# EAGLE design stm32103c8t6-v7 (EAGLE 7.4.0)
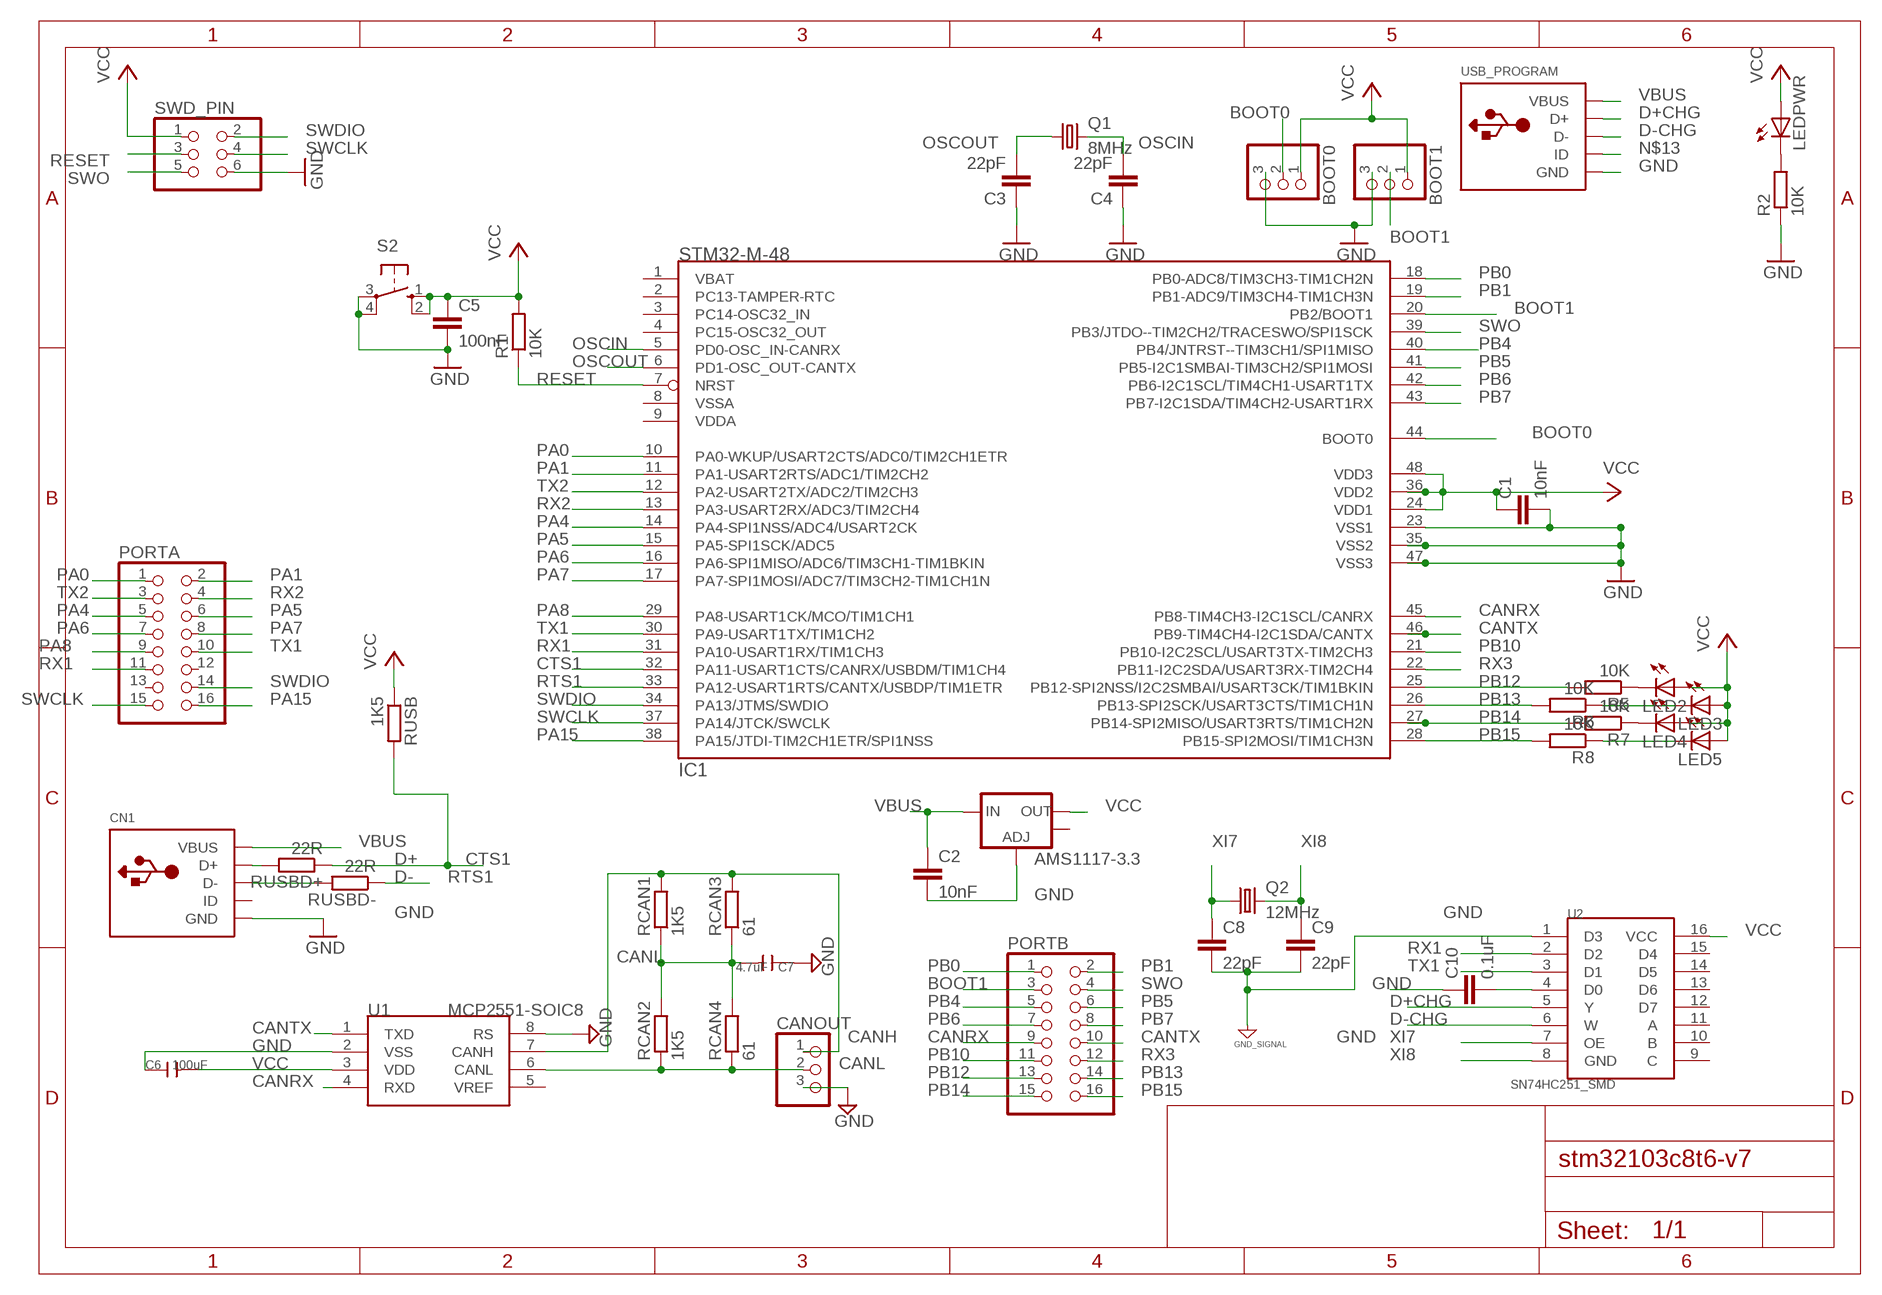
[diagram p0: schematic, sheet 1]

## Parts
AMS1117-3.3  V_REG_LM1117SOT223  [SOT223]
BOOT0  PINHD-1X3  [1X03]
BOOT1  PINHD-1X3  [1X03]
C1  10nF  C-EUC1210  [C1210]
C2  10nF  C-EUC1206  [C1206]
C3  22pF  C-EUC1210  [C1210]
C4  22pF  C-EUC1210  [C1210]
C5  100nF  C-EUC1206  [C1206]
C6  100uF  C-1206  [C1206]
C7  4.7uF  C-1206  [C1206]
C8  22pF  C-EUC1206  [C1206]
C9  22pF  C-EUC1206  [C1206]
C10  0.1uF  C-EUC1206  [C1206]
CANOUT  PINHD-1X3  [1X03]
CN1  USBTHM  [USB-MINIB-THM]
IC1  STM32-M-48  [LQFP48]
LED2  LEDSMT1206  [1206]
LED3  LEDSMT1206  [1206]
LED4  LEDSMT1206  [1206]
LED5  LEDSMT1206  [1206]
LEDPWR  LEDSMT1206  [1206]
PORTA  PINHD-2X8  [2X08]
PORTB  PINHD-2X8  [2X08]
Q1  8MHz  CRYSTALHC49S  [HC49/S]
Q2  12MHz  CRYSTALHC49S  [HC49/S]
R1  10K  R-EU_R1206  [R1206]
R2  10K  R-EU_R1206  [R1206]
R5  10K  R-EU_R1206  [R1206]
R6  10K  R-EU_R1206  [R1206]
R7  10K  R-EU_R1206  [R1206]
R8  10K  R-EU_R1206  [R1206]
RCAN1  1K5  R-EU_R1206  [R1206]
RCAN2  1K5  R-EU_R1206  [R1206]
RCAN3  61  R-EU_R1206  [R1206]
RCAN4  61  R-EU_R1206  [R1206]
RUSB  1K5  R-EU_R1206  [R1206]
RUSBD+  22R  R-EU_R1206  [R1206]
RUSBD-  22R  R-EU_R1206  [R1206]
S2  10-XX  [B3F-10XX]
SWD_PIN  PINHD-2X3  [2X03]
U1  MCP2551-SOIC8  [SOIC8-6.0]
U2  SN74HC251_SMD  [SO016]
USB_PROGRAM  USBTHM  [USB-MINIB-THM]

## Nets
BOOT0: BOOT0.2 IC1.44(BOOT0)
BOOT1: BOOT1.2 IC1.20(PB2/BOOT1) PORTB.3
CANH [CAN]: CANOUT.1 RCAN1.2 RCAN3.2 U1.7(CANH)
CANL [CAN]: CANOUT.2 RCAN2.1 RCAN4.1 U1.6(CANL)
CANRX: IC1.45(PB8-TIM4CH3-I2C1SCL/CANRX) PORTB.9 U1.4(RXD)
CANTX: IC1.46(PB9-TIM4CH4-I2C1SDA/CANTX) PORTB.10 U1.1(TXD)
CTS1: IC1.32(PA11-USART1CTS/CANRX/USBDM/TIM1CH4) RUSB.2 RUSBD+.1
D+: CN1.D+ RUSBD+.2
D+CHG: U2.5(Y) USB_PROGRAM.D+
D-: CN1.D- RUSBD-.2
D-CHG: U2.6(W) USB_PROGRAM.D-
GND [GND]: AMS1117-3.3.1(ADJ) BOOT0.3 BOOT1.3 C1.2 C2.2 C3.1 C4.1 C5.2 C6.1 C7.1 C8.2 C9.2 C10.1 CANOUT.3 CN1.GND IC1.23(VSS1) IC1.35(VSS2) IC1.47(VSS3) R2.1 S2.3(P) S2.4(P1) SWD_PIN.6 U1.2(VSS) U1.8(RS) U2.1(D3) USB_PROGRAM.GND ; supply symbol labelled GND_SIGNAL
N$4: LEDPWR.C R2.2
N$6: LED2.C R5.1
N$7: LED3.C R6.1
N$8: LED4.C R7.1
N$9: LED5.C R8.1
N$11: C10.2 U2.4(D0)
N$13: USB_PROGRAM.ID
OSCIN: C4.2 IC1.5(PD0-OSC_IN-CANRX) Q1.2
OSCOUT: C3.2 IC1.6(PD1-OSC_OUT-CANTX) Q1.1
PA0: IC1.10(PA0-WKUP/USART2CTS/ADC0/TIM2CH1ETR) PORTA.1
PA1: IC1.11(PA1-USART2RTS/ADC1/TIM2CH2) PORTA.2
PA4: IC1.14(PA4-SPI1NSS/ADC4/USART2CK) PORTA.5
PA5: IC1.15(PA5-SPI1SCK/ADC5) PORTA.6
PA6: IC1.16(PA6-SPI1MISO/ADC6/TIM3CH1-TIM1BKIN) PORTA.7
PA7: IC1.17(PA7-SPI1MOSI/ADC7/TIM3CH2-TIM1CH1N) PORTA.8
PA8: IC1.29(PA8-USART1CK/MCO/TIM1CH1) PORTA.9
PA15: IC1.38(PA15/JTDI-TIM2CH1ETR/SPI1NSS) PORTA.16
PB0: IC1.18(PB0-ADC8/TIM3CH3-TIM1CH2N) PORTB.1
PB1: IC1.19(PB1-ADC9/TIM3CH4-TIM1CH3N) PORTB.2
PB4: IC1.40(PB4/JNTRST--TIM3CH1/SPI1MISO) PORTB.5
PB5: IC1.41(PB5-I2C1SMBAI-TIM3CH2/SPI1MOSI) PORTB.6
PB6: IC1.42(PB6-I2C1SCL/TIM4CH1-USART1TX) PORTB.7
PB7: IC1.43(PB7-I2C1SDA/TIM4CH2-USART1RX) PORTB.8
PB10: IC1.21(PB10-I2C2SCL/USART3TX-TIM2CH3) PORTB.11
PB12: IC1.25(PB12-SPI2NSS/I2C2SMBAI/USART3CK/TIM1BKIN) PORTB.13 R5.2
PB13: IC1.26(PB13-SPI2SCK/USART3CTS/TIM1CH1N) PORTB.14 R6.2
PB14: IC1.27(PB14-SPI2MISO/USART3RTS/TIM1CH2N) PORTB.15 R7.2
PB15: IC1.28(PB15-SPI2MOSI/TIM1CH3N) PORTB.16 R8.2
RESET: IC1.7(NRST) R1.1 SWD_PIN.3
RTS1: IC1.33(PA12-USART1RTS/CANTX/USBDP/TIM1ETR) RUSBD-.1
RX1: IC1.31(PA10-USART1RX/TIM1CH3) PORTA.11 U2.2(D2)
RX2: IC1.13(PA3-USART2RX/ADC3/TIM2CH4) PORTA.4
RX3: IC1.22(PB11-I2C2SDA/USART3RX-TIM2CH4) PORTB.12
SWCLK: IC1.37(PA14/JTCK/SWCLK) PORTA.15 SWD_PIN.4
SWDIO: IC1.34(PA13/JTMS/SWDIO) PORTA.14 SWD_PIN.2
SWO: IC1.39(PB3/JTDO--TIM2CH2/TRACESWO/SPI1SCK) PORTB.4 SWD_PIN.5
TX1: IC1.30(PA9-USART1TX/TIM1CH2) PORTA.10 U2.3(D1)
TX2: IC1.12(PA2-USART2TX/ADC2/TIM2CH3) PORTA.3
UNIC: C7.2 RCAN1.1 RCAN2.2 RCAN3.1 RCAN4.2
VBUS: AMS1117-3.3.3(IN) C2.1 CN1.VBUS USB_PROGRAM.VBUS
VCC [POWER]: AMS1117-3.3.2(OUT) BOOT0.1 BOOT1.1 C1.1 C5.1 C6.2 IC1.24(VDD1) IC1.36(VDD2) IC1.48(VDD3) LED2.A LED3.A LED4.A LED5.A LEDPWR.A R1.2 RUSB.1 S2.1(S) S2.2(S1) SWD_PIN.1 U1.3(VDD) U2.16(VCC)
XI7: C8.1 Q2.1 U2.7(OE)
XI8: C9.1 Q2.2 U2.8(GND)
Unconnected: AMS1117-3.3.4(OUT) CN1.ID IC1.1(VBAT) IC1.2(PC13-TAMPER-RTC) IC1.3(PC14-OSC32_IN) IC1.4(PC15-OSC32_OUT) IC1.8(VSSA) IC1.9(VDDA) PORTA.12 PORTA.13 U1.5(VREF) U2.9(C) U2.10(B) U2.11(A) U2.12(D7) U2.13(D6) U2.14(D5) U2.15(D4)

## Library data of the parts
AMS1117-3.3 = SparkFun-PowerIC:V_REG_LM1117: Voltage Regulator LM1117 Standard adjustable voltage regulator but in SMD form. Spark Fun Electronics SKU : COM-00595
BOOT0 BOOT1 CANOUT = pinhead:PINHD-1X3: PIN HEADER
C1-C5 C8-C10 = rcl:C-EU: CAPACITOR, European symbol
C6 C7 = Discrete:C*: Ceramic Capacitors
CN1 USB_PROGRAM = adafruit:USB: USB Connectors USBMINIB - Surface Mount Female Mini-B USB Connector 4UConnector: 06564 By microbuilder.eu Thru-hole RA Female Mini-B USB Connector 4UConnector: 18732 By ladyada.net
IC1 = pel_stm32:STM32-M-48: STM32F103 Medium Density 48pins
LED2-LED5 LEDPWR = led:LED: LED OSRAM: - CHIPLED LG R971, LG N971, LY N971, LG Q971, LY Q971, LO R971, LY R971 LH N974, LH R974 LS Q976, LO Q976, LY Q976 LO Q996 - Hyper CHIPLED LW Q18S LB Q993, LB Q99A, LB R99A - SideLED LS A670, LO A670, LY A670, LG A670, LP A670 LB A673, LV A673, LT A673, LW A673 LH A674 LY A675 LS A676, LA A676, LO A676, LY A676, LW A676 LS A679, LY A679, LG A679 - Hyper Micro SIDELED® LS Y876, LA Y876, LO Y876, LY Y876 LT Y87S - SmartLED LW L88C, LW L88S LB L89C, LB L89S, LG L890 LS L89K, LO L89K, LY L89K LS L896, LA L896, LO L896, LY L896 - TOPLED LS T670, LO T670, LY T670, LG T670, LP T670 LSG T670, LSP T670, LSY T670, LOP T670, LYG T670 LG T671, LOG T671, LSG T671 LB T673, LV T673, LT T673, LW T673 LH T674 LS T676, LA T676, LO T676, LY T676, LB T676, LH T676, LSB T676, LW T676 LB T67C, LV T67C, LT T67C, LS T67K, LO T67K, LY T67K, LW E67C LS E67B, LA E67B, LO E67B, LY E67B, LB E67C, LV E67C, LT E67C LW T67C LS T679, LY T679, LG T679 LS T770, LO T770, LY T770, LG T770, LP T770 LB T773, LV T773, LT T773, LW T773 LH T774 LS E675, LA E675, LY E675, LS T675 LS T776, LA T776, LO T776, LY T776, LB T776 LHGB T686 LT T68C, LB T68C - Hyper Mini TOPLED® LB M676 - Mini TOPLED Santana® LG M470 LS M47K, LO M47K, LY M47K Source: http://www.osram.convergy.de LUXEON: - LUMILED® LXK2-PW12-R00, LXK2-PW12-S00, LXK2-PW14-U00, LXK2-PW14-V00 LXK2-PM12-R00, LXK2-PM12-S00, LXK2-PM14-U00 LXK2-PE12-Q00, LXK2-PE12-R00, LXK2-PE12-S00, LXK2-PE14-T00, LXK2-PE14-U00 LXK2-PB12-K00, LXK2-PB12-L00, LXK2-PB12-M00, LXK2-PB14-N00, LXK2-PB14-P00, LXK2-PB14-Q00 LXK2-PR12-L00, LXK2-PR12-M00, LXK2-PR14-Q00, LXK2-PR14-R00 LXK2-PD12-Q00, LXK2-PD12-R00, LXK2-PD12-S00 LXK2-PH12-R00, LXK2-PH12-S00 LXK2-PL12-P00, LXK2-PL12-Q00, LXK2-PL12-R00 Source: www.luxeon.com KINGBRIGHT: KA-3528ASYC Source: www.kingbright.com
PORTA PORTB = pinhead:PINHD-2X8: PIN HEADER
Q1 Q2 = crystal:CRYSTAL: CRYSTAL; OC_FARNELL: 1667008; OC_NEWARK: unknown
R1 R2 R5-R8 RCAN1-RCAN4 RUSB RUSBD+ RUSBD- = resistor:R-EU_: RESISTOR, European symbol
S2 = switch-omron:10-XX: OMRON SWITCH; MPN: B3F-1000; OC_FARNELL: 176432; OC_NEWARK: 36M3542
SWD_PIN = pinhead:PINHD-2X3: PIN HEADER
U1 = IC:MCP2551: High-Speed CAN Transceiver http://ww1.microchip.com/downloads/en/devicedoc/21667f.pdf
U2 = SparkFun-DigitalIC:SN74HC251: SN54HC251 Data Selector/Multiplexer

## Net classes
0 default: clearance 0.205 mm
1 POWER: clearance 0.205 mm to class 0, clearance 0.205 mm
2 GND: clearance 0.205 mm to class 0, clearance 0.205 mm to class 1, clearance 0.205 mm
3 CAN: width 0.254 mm, clearance 0.205 mm to class 0, clearance 0.205 mm to class 1, clearance 0.205 mm to class 2, clearance 0.205 mm

## Board
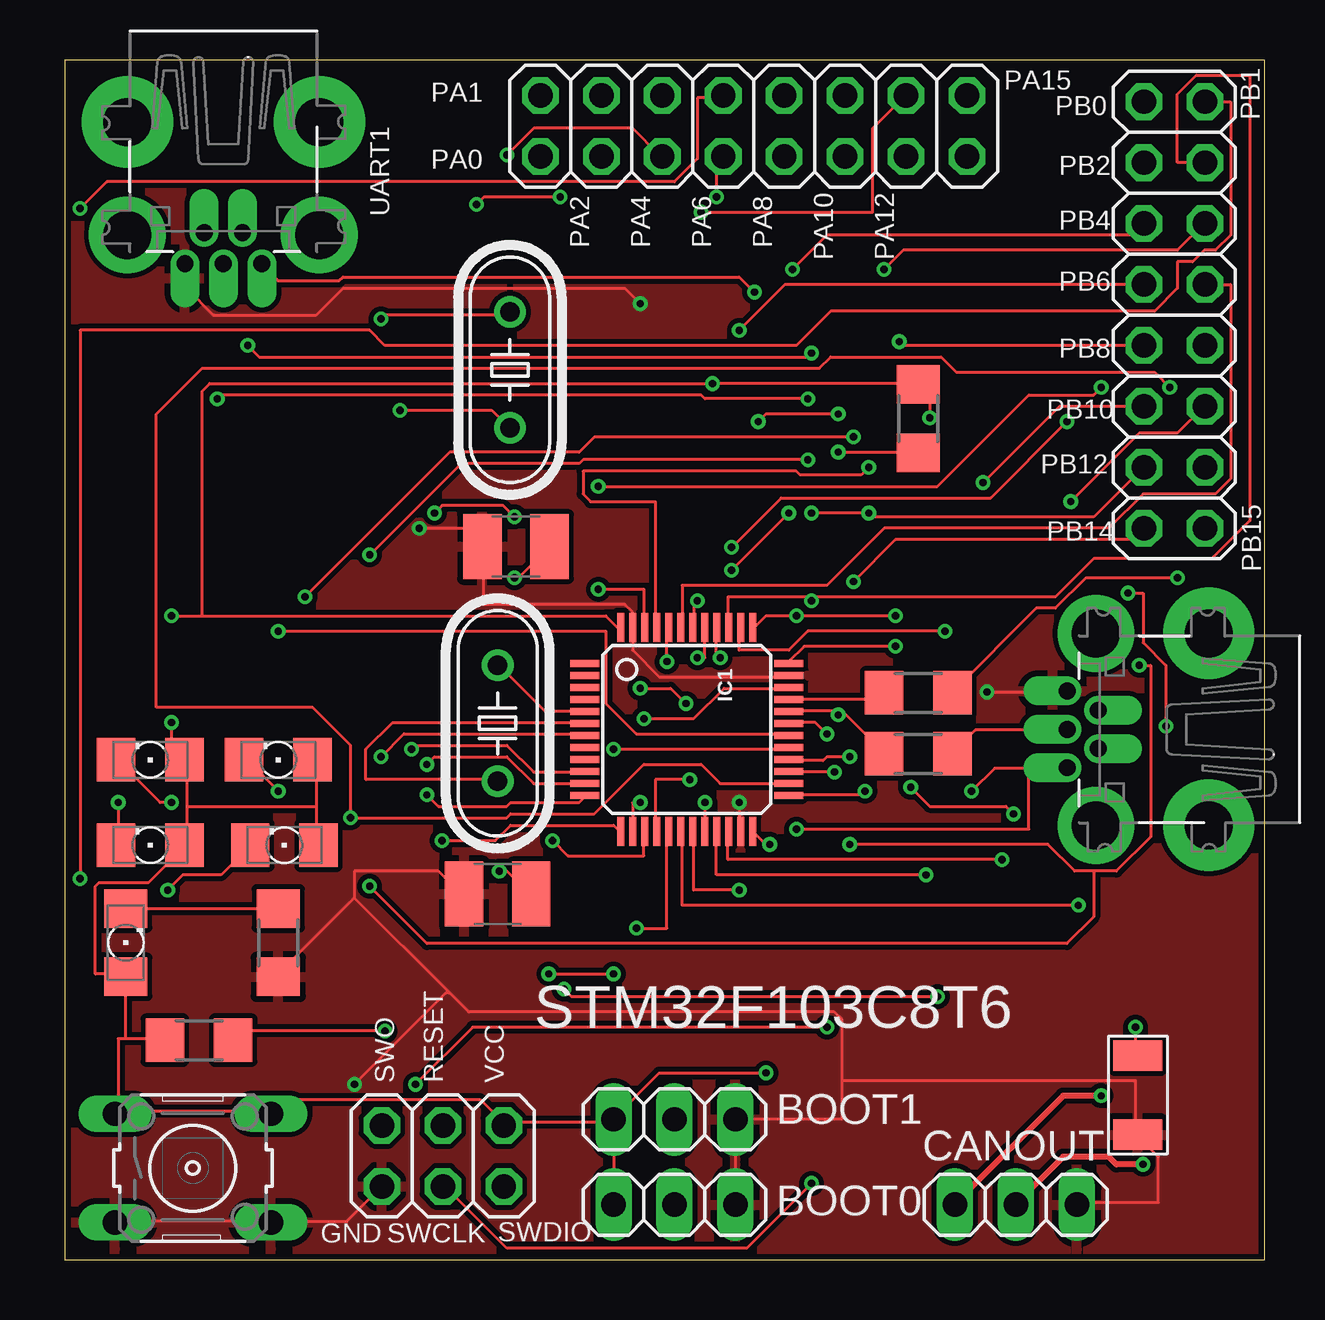
[diagram p1: board, top side]
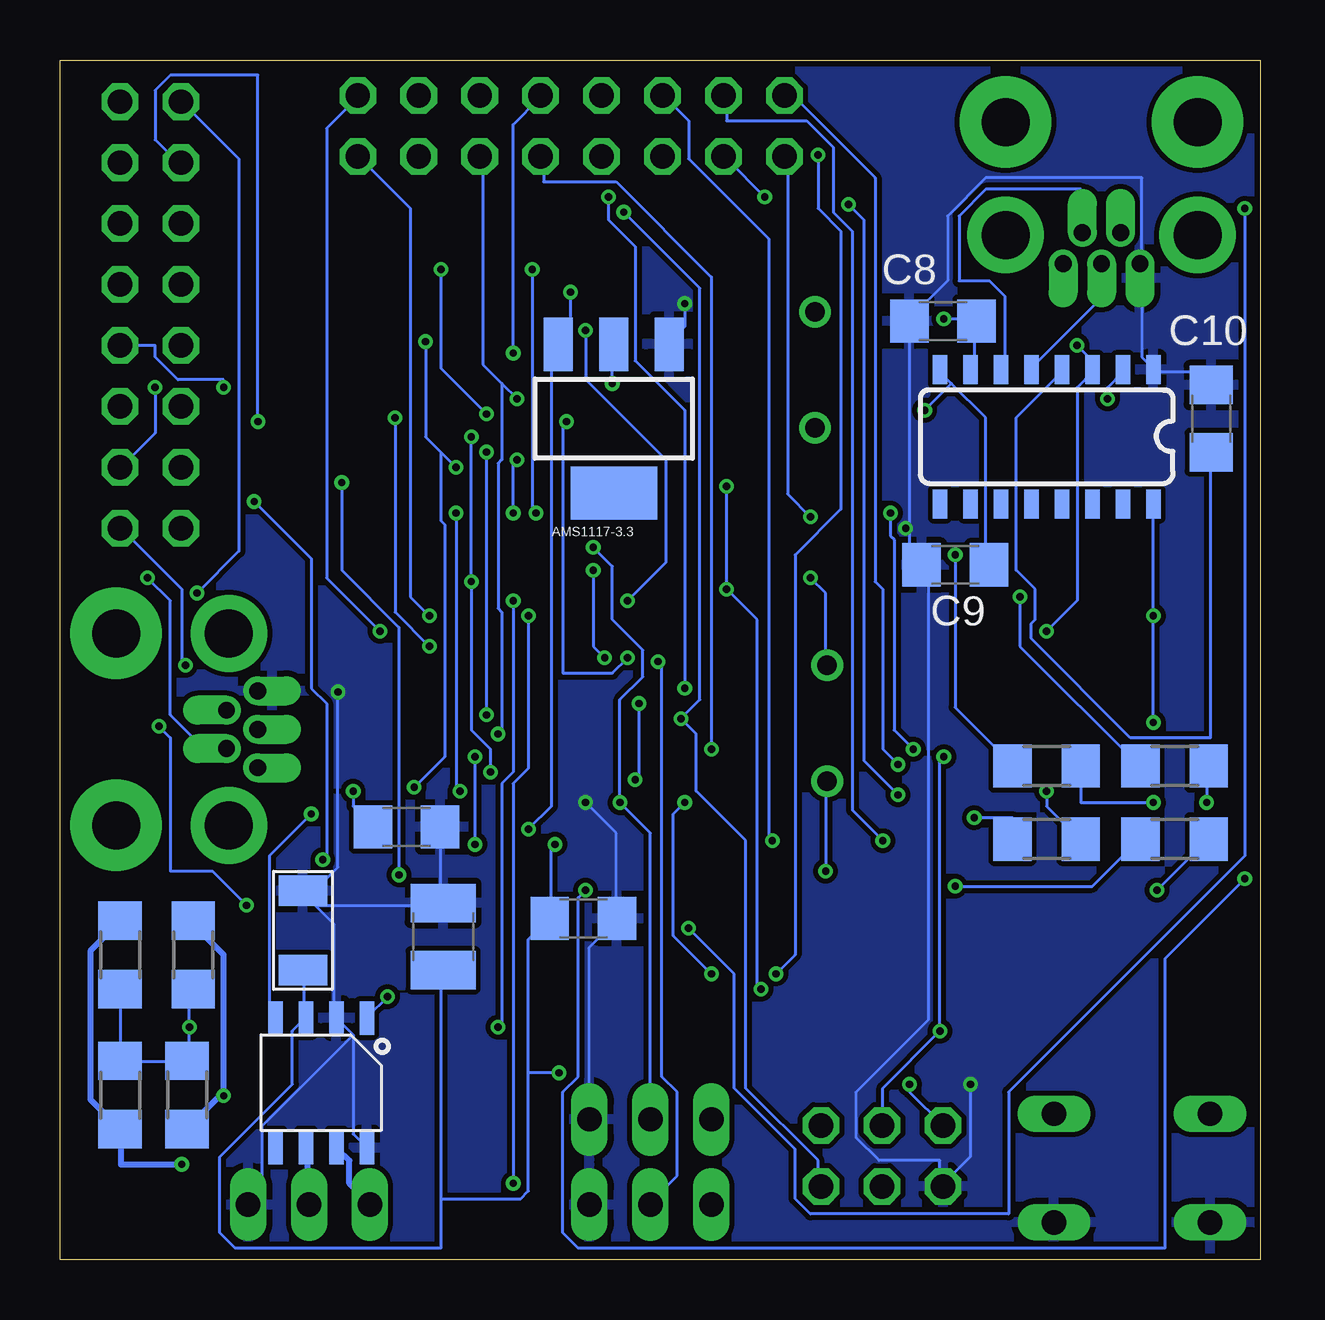
[diagram p2: board, bottom side, seen from below]

Size 50 x 50 mm. Coordinates in mm from the lower left corner, seen from the top.
Outline: 0,0 50,0 50,50 0,50 0,0
Copper layers (1*16): Top 0.035mm / dielectric 1.5mm / Bottom 0.035mm
Design rules "dirt_cheap_dirty_boards.v1": minimum track width 5mil, minimum drill 12mil, track to track 5mil, track to pad 5mil, pad to pad 5mil, via to via 5mil, smd to smd 0mil, copper to edge 10mil, drill to drill 10mil, minimum pad ring 10mil, minimum via ring 6mil, stop-mask expansion 2mil, vias tented up to drill 25mil, thermal gap 10mil

### Footprints (pad centres in the part's own frame; a part is rotated, then mirrored left to right if it is on the bottom)
SOT223 = smd 1.219 x 2.235: 1 -2.311,-3.099; 2 0,-3.099; 3 2.311,-3.099 | smd 3.6 x 2.2: 4 0,3.099
1X03 = drill 1.016 long: 1 -2.54,0; 2 0,0; 3 2.54,0
C1210 = smd 1.6 x 2.7: 1 -1.4,0; 2 1.4,0
C1206 = smd 1.6 x 1.8: 1 -1.4,0; 2 1.4,0
C1206' = smd 1.27 x 2.032: 1 -1.651,0; 2 1.651,0
USB-MINIB-THM = drill 0.7 offset: D+ 0,9.8; D- -0.8,8.5; GND 1.6,9.8; ID 0.8,8.5; VBUS -1.6,9.8 | drill 2 pad 3.81: GND1 -4,3.9; GND4 4,3.9 | drill 2 pad 3.2: GND2 -4,8.6; GND3 4,8.6
LQFP48 = smd 0.3 x 1.2: 1 -2.75,-4.25; 2 -2.25,-4.25; 3 -1.75,-4.25; 4 -1.25,-4.25; 5 -0.75,-4.25; 6 -0.25,-4.25; 7 0.25,-4.25; 8 0.75,-4.25; 9 1.25,-4.25; 10 1.75,-4.25; 11 2.25,-4.25; 12 2.75,-4.25; 25 2.75,4.25; 26 2.25,4.25; 27 1.75,4.25; 28 1.25,4.25; 29 0.75,4.25; 30 0.25,4.25; 31 -0.25,4.25; 32 -0.75,4.25; 33 -1.25,4.25; 34 -1.75,4.25; 35 -2.25,4.25; 36 -2.75,4.25 | smd 1.2 x 0.3: 13 4.25,-2.75; 14 4.25,-2.25; 15 4.25,-1.75; 16 4.25,-1.25; 17 4.25,-0.75; 18 4.25,-0.25; 19 4.25,0.25; 20 4.25,0.75; 21 4.25,1.25; 22 4.25,1.75; 23 4.25,2.25; 24 4.25,2.75; 37 -4.25,2.75; 38 -4.25,2.25; 39 -4.25,1.75; 40 -4.25,1.25; 41 -4.25,0.75; 42 -4.25,0.25; 43 -4.25,-0.25; 44 -4.25,-0.75; 45 -4.25,-1.25; 46 -4.25,-1.75; 47 -4.25,-2.25; 48 -4.25,-2.75
1206 = smd 1.6 x 1.803: A -1.422,0; C 1.422,0
2X08 = drill 1.016 octagon: 1 -8.89,-1.27; 2 -8.89,1.27; 3 -6.35,-1.27; 4 -6.35,1.27; 5 -3.81,-1.27; 6 -3.81,1.27; 7 -1.27,-1.27; 8 -1.27,1.27; 9 1.27,-1.27; 10 1.27,1.27; 11 3.81,-1.27; 12 3.81,1.27; 13 6.35,-1.27; 14 6.35,1.27; 15 8.89,-1.27; 16 8.89,1.27
HC49/S = drill 0.813: 1 -2.413,0; 2 2.413,0
R1206 = smd 1.6 x 1.803: 1 -1.422,0; 2 1.422,0
B3F-10XX = drill 1.016 long: 1 -3.251,2.261; 2 3.251,2.261; 3 -3.251,-2.261; 4 3.251,-2.261
2X03 = drill 1.016 octagon: 1 -2.54,-1.27; 2 -2.54,1.27; 3 0,-1.27; 4 0,1.27; 5 2.54,-1.27; 6 2.54,1.27
SOIC8-6.0 = smd 0.6 x 1.4: 1 -1.905,-2.7; 2 -0.635,-2.7; 3 0.635,-2.7; 4 1.905,-2.7; 5 1.905,2.7; 6 0.635,2.7; 7 -0.635,2.7; 8 -1.905,2.7
SO016 = smd 0.6 x 1.2: 1 -4.445,-2.8; 2 -3.175,-2.8; 3 -1.905,-2.8; 4 -0.635,-2.8; 5 0.635,-2.8; 6 1.905,-2.8; 7 3.175,-2.8; 8 4.445,-2.8; 9 4.445,2.8; 10 3.175,2.8; 11 1.905,2.8; 12 0.635,2.8; 13 -0.635,2.8; 14 -1.905,2.8; 15 -3.175,2.8; 16 -4.445,2.8

### Placement (x,y rotation side)
AMS1117-3.3  26.92,35.05 180 bottom
BOOT0  25.4,2.29 0 top
BOOT1  25.4,5.84 0 top
C1  34.04,13.46 90 bottom
C2  35.56,18.03 0 bottom
C3  18.03,15.24 0 top
C4  18.8,29.72 0 top
C5  28.19,14.22 0 bottom
C6  100uF  [C1206']  39.88,13.72 270 bottom
C7  4.7uF  [C1206']  44.7,6.86 90 top
C8  13.21,39.12 180 bottom
C9  12.7,28.96 180 bottom
C10  2.03,35.05 270 bottom
CANOUT  39.62,2.29 0 top
CN1  51.56,22.1 90 top
IC1  25.91,22.1 270 top
LED2  3.56,20.83 180 top
LED3  8.89,20.83 180 top
LED4  3.56,17.27 180 top
LED5  9.14,17.27 180 top
LEDPWR  2.54,13.21 90 top
PORTA  28.7,47.24 0 top
PORTB  46.23,39.37 270 top
Q1  18.03,22.35 90 top
Q2  18.54,37.08 270 top
R1  5.59,9.14 180 top
R2  8.89,13.21 90 top
R5  8.89,20.57 180 bottom
R6  8.89,17.53 180 bottom
R7  3.56,20.57 180 bottom
R8  3.56,17.53 180 bottom
RCAN1  44.45,12.7 90 bottom
RCAN2  47.5,12.7 270 bottom
RCAN3  44.7,6.86 270 bottom
RCAN4  47.5,6.86 90 bottom
RUSB  35.56,35.05 270 top
RUSBD+  35.56,21.08 0 top
RUSBD-  35.56,23.62 0 top
S2  5.33,3.81 0 top
SWD_PIN  15.75,4.32 180 top
U1  39.12,7.37 180 bottom
U2  8.89,34.29 180 bottom
USB_PROGRAM  6.6,51.31 180 top

### Tracks (layer width: path | path; a pad name or v marks a point on that pad's centre or on a via)
BOOT0  (via drill 0.3)
  Top 0.127: v25.08,24.92 25.08,26.19 IC1.44
  Bottom 0.127: v25.08,24.92 24.92,24.77 24.92,7.62 24.29,6.99 24.29,3.49 25.4,2.38 BOOT0.2
BOOT1  (via drill 0.3)
  Top 0.127: v26.67,19.05 26.67,17.94 IC1.20 | v41.75,34.92 38.58,31.75 29.84,31.75 v27.78,29.69
  Bottom 0.127: BOOT1.2 25.4,17.78 v26.67,19.05 26.67,23.34 25.72,24.29 25.72,25.4 26.99,26.67 26.99,28.89 v27.78,29.69 | v41.75,34.92 41.75,49.37 45.4,49.37 46.04,48.74 46.04,46.67 45.09,45.72 PORTB.3
CANH  (via drill 0.3)
  Top 0.254: v43.18,6.83 41.59,6.83 37.15,2.38 CANOUT.1
  Bottom 0.254: U1.7 38.42,4.6 37.94,4.13 37.94,3.17 37.15,2.38 CANOUT.1 | 43.26,6.91 44.61,5.56 RCAN3.2 | 43.26,6.91 43.18,6.99 43.18,12.7 44.45,13.97 RCAN1.2 | v43.18,6.83 43.26,6.91
CANL  (via drill 0.3)
  Top 0.254: v44.93,3.97 43.81,3.97 43.5,4.29 41.59,4.29 39.69,2.38 CANOUT.2
  Bottom 0.254: U1.6 39.69,4.6 39.69,2.38 CANOUT.2 | RCAN2.1 47.62,13.97 48.74,12.86 48.74,6.67 47.62,5.56 RCAN4.1 47.47,5.4 47.47,3.97 v44.93,3.97
CANRX  (via drill 0.3)
  Top 0.127: v33.5,33.02 33.18,32.7 30.64,32.7 30.48,32.86 21.59,32.86 21.59,31.91 21.91,31.59 24.61,31.59 24.61,26.35 IC1.45 | v34.77,38.26 34.92,38.1 PORTB.9 | v39.53,18.57 39.21,18.89 36.04,18.89 v35.24,19.68
  Bottom 0.127: 34.13,33.66 34.77,34.29 v34.77,38.26 | 34.13,33.66 v33.5,33.02 | v39.53,18.57 41.27,16.83 41.27,10.32 41.12,10.16 U1.4 | v35.24,19.68 33.97,20.95 33.97,30.64 34.13,30.8 34.13,33.66
CANTX  (via drill 0.3)
  Top 0.127: v22.23,27.94 24.13,27.94 24.13,26.35 IC1.46 | v20.8,11.27 21.11,10.95 v36.35,10.95 | v43.18,36.35 42.86,36.04 40.16,36.04 36.35,32.23 v22.23,32.23
  Bottom 0.127: v20.8,11.27 20.95,11.43 20.95,26.67 v22.23,27.94 v22.23,32.23 | v36.35,10.95 37.15,10.16 U1.1 | PORTB.10 46.04,38.1 46.04,37.62 45.09,36.67 43.18,36.67 v43.18,36.35
CTS1  (via drill 0.3)
  Top 0.127: 32.23,22.86 32.38,22.86 34.13,21.11 RUSBD+.1 | 32.23,22.86 IC1.32 | v32.23,33.66 35.56,33.66 RUSB.2 | 32.23,22.86 v32.23,22.7
  Bottom 0.127: v32.23,22.7 v32.23,33.66
D+
  Top 0.127: RUSBD+.2 36.99,21.11 37.94,22.07 41.75,22.07 CN1.D+
D+CHG
  Bottom 0.127: U2.5 9.53,37.15 6.67,40.01 6.67,41.43 USB_PROGRAM.D+
D-  (via drill 0.3)
  Top 0.127: v46.35,28.42 42.55,28.42 41.27,27.15 40.48,27.15 36.99,23.65 RUSBD-.2
  Bottom 0.127: v46.35,28.42 45.4,27.46 45.4,22.7 44.13,21.43 43.18,21.43 CN1.D-
D-CHG
  Bottom 0.127: U2.6 10.79,37.15 10.64,37.31 10.64,40.16 11.27,40.8 12.54,40.8 12.54,43.5 11.43,44.61 7.46,44.61 7.46,42.86 USB_PROGRAM.D-
GND  (via drill 0.3)
  Top 0.127: IC1.35 30,24.29 24.77,24.29 23.65,25.4 23.65,26.19 IC1.47 23.65,26.99 23.34,27.3 17.46,27.3 17.46,29.69 C4.1 17.3,29.84 16.67,30.48 v14.76,30.48 | v23.97,39.85 23.34,40.48 11.59,40.48 10.48,39.37 6.19,39.37 5.08,40.48 5.08,41.43 USB_PROGRAM.GND | CANOUT.3 42.23,2.38 45.56,2.38 45.56,4.29 44.77,5.08 C7.1 44.61,5.24 44.61,7.46 32.38,7.46 | v38.42,23.65 41.75,23.65 CN1.GND | S2.3 2.22,1.59 8.57,1.59 S2.4 8.73,1.59 11.75,1.59 SWD_PIN.6 | 12.06,15.08 8.89,11.91 R2.1 | 12.06,15.08 12.06,16.19 15.56,16.19 16.51,15.24 C3.1 | v28.1,19.05 28.1,17.94 IC1.23 | BOOT0.3 BOOT1.3 27.94,5.87 32.38,5.87 32.38,7.46 | 16.03,11.11 16.83,10.32 32.07,10.32 32.38,10 32.38,7.46 | 16.03,11.11 12.06,15.08 | v12.06,7.3 15.88,11.11 16.03,11.11
  Bottom 0.127: 14.61,30.48 14.61,39.05 C8.2 14.61,39.21 13.02,40.8 13.02,43.5 11.43,45.09 4.92,45.09 4.92,41.59 USB_PROGRAM.GND 4.92,41.43 4.92,37.62 4.45,37.15 U2.1 4.45,36.99 2.06,36.99 2.06,36.51 C10.1 | 14.61,30.48 14.61,29.53 14.13,29.05 C9.2 13.97,28.89 13.81,28.73 13.81,10 16.83,6.99 16.83,5.08 15.88,4.13 13.34,4.13 13.34,3.17 SWD_PIN.6 13.18,3.17 12.06,4.29 v12.06,7.3 | v23.97,39.85 23.97,38.89 24.61,38.26 AMS1117-3.3.1 | 14.61,30.48 v14.76,30.48 | C2.2 34.13,17.94 34.13,14.92 C1.2 34.13,14.76 39.37,14.76 | 37.78,9.37 37.78,5.24 37.31,4.76 U1.8 | 37.78,9.37 38.42,10 U1.2 38.58,10.16 38.58,13.97 39.37,14.76 | 39.37,14.76 39.69,15.08 | 39.69,15.08 39.85,15.24 C6.1 | v38.42,23.65 38.42,16.35 39.69,15.08 | 39.69,15.08 C6.1 | 39.37,14.76 C6.1 | CANOUT.3 41.59,2.86 41.59,5.56 37.78,9.37 | v28.1,19.05 26.83,17.78 26.83,14.29 C5.2 26.83,14.13 27.94,13.02 BOOT1.3
  pour Bottom: 0.25,49.78 0.25,0.25 49.78,0.25 49.78,49.78
  pour Top: 49.78,0.25 0.25,0.25 0.25,49.78 49.78,49.78
N$4
  Top 0.127: LEDPWR.C 2.54,14.61 8.89,14.61 R2.2
N$6  (via drill 0.3)
  Top 0.127: v4.45,19.05 3.97,19.05 2.22,20.8 LED2.C
  Bottom 0.127: v4.45,19.05 7.46,19.05 7.46,20.48 R5.1
N$7  (via drill 0.3)
  Top 0.127: v8.89,19.53 7.62,20.8 LED3.C
  Bottom 0.127: v8.89,19.53 8.89,18.89 7.62,17.62 R6.1
N$8  (via drill 0.3)
  Top 0.127: v2.22,19.05 2.22,17.3 LED4.C
  Bottom 0.127: v2.22,19.05 2.22,20.48 R7.1
N$9  (via drill 0.3)
  Top 0.127: v4.29,15.4 4.92,16.03 6.51,16.03 7.62,17.14 LED5.C
  Bottom 0.127: v4.29,15.4 2.22,17.46 R8.1
N$11
  Bottom 0.127: U2.4 8.26,36.99 10.16,35.08 10.16,28.73 9.37,27.94 9.37,26.67 9.53,26.51 9.53,25.88 5.4,21.75 2.06,21.75 2.06,33.5 C10.2
OSCIN  (via drill 0.3)
  Top 0.127: IC1.5 21.59,22.86 20,22.86 18.1,24.77 Q1.2 | v18.73,28.42 18.89,28.42 20.16,29.69 C4.2
  Bottom 0.127: v18.73,28.42 18.1,27.78 18.1,24.77 Q1.2
OSCOUT  (via drill 0.3)
  Top 0.127: IC1.6 21.59,22.38 13.65,22.38 12.54,21.27 12.54,20 17.94,20 Q1.1 | v18.1,16.19 18.41,16.19 19.37,15.24 C3.2
  Bottom 0.127: v18.1,16.19 18.1,19.84 Q1.1
PA0  (via drill 0.3)
  Top 0.127: v14.45,21.27 14.61,21.43 18.41,21.43 19.53,20.32 21.59,20.32 IC1.10 | v15.4,31.11 15.72,31.43 18.26,31.43 v18.73,30.96
  Bottom 0.127: v14.45,21.27 15.24,22.07 15.24,30 15.4,30.16 v15.4,31.11 | v18.73,30.96 19.68,31.91 19.68,45.88 PORTA.1
PA1  (via drill 0.3)
  Top 0.127: v15.08,20.64 15.4,20.95 18.41,20.95 19.53,19.84 21.59,19.84 IC1.11
  Bottom 0.127: v15.08,20.64 15.72,21.27 15.72,27.94 16.03,28.26 16.03,45.09 19.37,48.42 19.68,48.42 PORTA.2
PA4  (via drill 0.3)
  Top 0.127: v23.97,19.05 23.65,19.05 23.65,17.94 IC1.14 | v20.16,11.91 v22.86,11.91 | v18.41,46.04 19.53,47.15 23.65,47.15 24.77,46.04 PORTA.5
  Bottom 0.127: v23.97,19.05 24.45,18.57 24.45,13.49 v22.86,11.91 | v20.16,11.91 19.37,12.7 19.37,29.37 17.46,31.27 17.46,42.86 18.41,43.81 v18.41,46.04
PA5  (via drill 0.3)
  Top 0.127: v20.32,17.46 20.95,16.83 24.13,16.83 24.13,17.78 IC1.15
  Bottom 0.127: v20.32,17.46 20.48,17.62 20.48,42.55 23.81,45.88 23.81,47.47 24.77,48.42 PORTA.6
PA6  (via drill 0.3)
  Top 0.127: v26.04,20 24.61,20 24.61,17.94 IC1.16 | v25.88,23.18 25.24,23.81 v23.97,23.81 | v27.15,44.29 27.15,45.88 27.3,45.88 PORTA.7
  Bottom 0.127: v26.04,20 25.88,20.16 v25.88,23.18 | v23.97,23.81 23.97,35.4 26.04,37.47 26.04,42.23 27.15,43.34 v27.15,44.29
PA7  (via drill 0.3)
  Top 0.127: v23.81,13.81 25.08,13.81 25.08,17.78 IC1.17 | v0.64,43.81 1.75,44.93 25.4,44.93 26.35,45.88 26.35,48.42 27.3,48.42 PORTA.8
  Bottom 0.127: v23.81,13.81 21.91,11.91 21.91,7.14 19.37,4.6 19.37,2.54 18.73,1.91 10.48,1.91 10.48,6.99 0.64,16.83 v0.64,43.81
PA8  (via drill 0.3)
  Top 0.127: v22.86,21.27 30,21.27 IC1.29
  Bottom 0.127: v22.86,21.27 22.86,40.96 26.83,44.93 29.84,44.93 29.84,45.88 PORTA.9
PA15  (via drill 0.3)
  Top 0.127: v36.67,26.19 30.96,26.19 30.16,25.4 28.1,25.4 28.1,26.19 IC1.38
  Bottom 0.127: v36.67,26.19 38.89,28.42 38.89,47.15 37.62,48.42 PORTA.16
PB0  (via drill 0.3)
  Top 0.127: v42.23,14.76 25.72,14.76 25.72,17.78 IC1.18 | v45.88,22.23 45.88,24.77 44.93,25.72 44.93,27.78 v44.29,27.78
  Bottom 0.127: v42.23,14.76 43.66,16.19 45.4,16.19 45.4,21.75 v45.88,22.23 | v44.29,27.78 42.55,29.53 42.55,45.88 44.93,48.26 PORTB.1
PB1  (via drill 0.3)
  Top 0.127: v28.1,15.4 26.19,15.4 26.19,17.78 IC1.19 | v0.64,15.88 0.64,38.73 12.7,38.73 13.34,38.1 30.48,38.1 31.91,39.53 45.4,39.53 46.35,40.48 46.35,41.59 46.99,41.59 47.47,42.07 47.94,42.07 48.58,42.7 48.58,48.26 PORTB.2
  Bottom 0.127: v28.1,15.4 28.42,15.08 28.42,7.62 29.05,6.99 29.05,1.11 28.42,0.48 3.97,0.48 3.97,12.54 v0.64,15.88
PB4  (via drill 0.3)
  Top 0.127: v27.3,25.08 27.15,25.08 27.15,26.19 IC1.40 | v30.16,31.11 v27.78,28.73 | v30.32,41.27 31.75,42.7 44.45,42.7 44.93,43.18 PORTB.5
  Bottom 0.127: v27.3,25.08 27.78,25.56 v27.78,28.73 | v30.16,31.11 30.32,31.27 v30.32,41.27
PB5  (via drill 0.3)
  Top 0.127: v26.35,25.08 26.67,25.08 26.67,26.19 IC1.41 | v28.89,34.92 29.21,35.24 v32.23,35.24 | v34.13,41.27 34.92,42.07 46.35,42.07 47.47,43.18 PORTB.6
  Bottom 0.127: v26.35,25.08 26.99,24.45 29.05,24.45 29.05,34.77 v28.89,34.92 | v32.23,35.24 34.13,37.15 v34.13,41.27
PB6  (via drill 0.3)
  Top 0.127: v26.35,27.46 26.19,27.46 26.19,26.35 IC1.42 | v28.1,38.73 30,40.64 PORTB.7
  Bottom 0.127: v26.35,27.46 24.77,29.05 24.77,33.34 28.1,36.67 v28.1,38.73
PB7
  Top 0.127: PORTB.8 48.58,40.64 48.58,32.54 47.94,31.91 44.93,31.91 43.5,30.48 34.13,30.48 31.75,28.1 25.72,28.1 25.72,26.35 IC1.43
PB10  (via drill 0.3)
  Top 0.127: v35.88,16.03 27.15,16.03 27.15,17.78 IC1.21 | v38.26,32.38 41.43,35.56 PORTB.11
  Bottom 0.127: v35.88,16.03 35.88,26.35 38.26,28.73 v38.26,32.38
PB12  (via drill 0.3)
  Top 0.127: v33.34,19.53 33.18,19.37 30.16,19.37 IC1.25 | PORTB.13 44.93,33.02 42.86,30.96 33.66,30.96 v33.5,31.11 v31.11,31.11 | v12.7,29.37 16.51,33.18 21.43,33.18 21.59,33.34 v30.96,33.34
  Bottom 0.127: v33.34,19.53 33.5,19.68 v33.5,31.11 | v12.7,29.37 12.7,23.02 10.32,20.64 R5.2 | v30.96,33.34 31.11,33.18 v31.11,31.11
PB13  (via drill 0.3)
  Top 0.127: IC1.26 30,19.84 27.3,19.84 26.51,20.64 24.13,20.64 22.07,18.57 18.57,18.57 18.41,18.41 v11.91,18.41 11.91,21.43 10.32,23.02 3.81,23.02 3.81,35.24 5.71,37.15 31.43,37.15 31.91,37.62 36.51,37.62 37.15,36.99 45.4,36.99 v46.04,36.35
  Bottom 0.127: v11.91,18.41 10.32,18.41 10.32,17.62 R6.2 | v46.04,36.35 46.04,34.45 47.47,33.02 PORTB.14
PB14  (via drill 0.3)
  Top 0.127: v32.07,20.32 30.16,20.32 IC1.27 | v32.86,28.26 34.61,30 44.45,30 44.93,30.48 PORTB.15 | v10,27.62 16.03,33.66 21.43,33.66 22.07,34.29 v32.86,34.29
  Bottom 0.127: v32.07,20.32 32.07,21.27 32.86,22.07 v32.86,28.26 v32.86,34.29 | v10,27.62 10,25.56 5.08,20.64 R7.2
PB15  (via drill 0.3)
  Top 0.127: v32.7,20.95 31.75,20.95 31.59,20.8 30.16,20.8 IC1.28 | v32.7,17.3 40.96,17.3 42.07,16.19 42.86,16.19 | 42.86,16.19 43.81,16.19 45.24,17.62 45.24,24.77 v44.77,24.77 | v12.7,15.56 15.08,13.18 41.75,13.18 42.86,14.29 42.86,16.19
  Bottom 0.127: v32.7,17.3 v32.7,20.95 | v44.77,24.77 44.93,24.92 44.93,27.94 47.47,30.48 PORTB.16 | v12.7,15.56 6.99,15.56 5.08,17.46 R8.2
RESET  (via drill 0.3)
  Top 0.127: v13.18,20.95 14.13,21.91 21.59,21.91 IC1.7 | v13.34,9.53 7.46,9.53 7.14,9.21 R1.1
  Bottom 0.127: v13.18,20.95 13.34,20.8 v13.34,9.53 15.72,7.14 15.72,5.71 SWD_PIN.3
RTS1
  Top 0.127: IC1.33 30.16,23.34 33.97,23.34 34.13,23.5 RUSBD-.1
RX1  (via drill 0.3)
  Top 0.127: v6.35,35.88 6.51,36.04 26.51,36.04 26.67,35.88 v30.96,35.88 | v31.75,21.91 31.27,22.38 30.16,22.38 IC1.31
  Bottom 0.127: v6.35,35.88 6.35,36.35 5.71,36.99 U2.2 | 31.59,36.51 32.38,37.31 32.38,45.88 PORTA.11 | 31.59,36.51 v30.96,35.88 | v31.75,21.91 31.59,22.07 31.59,26.99 31.75,27.15 31.75,33.18 31.59,33.34 31.59,36.51
RX2  (via drill 0.3)
  Top 0.127: v15.72,17.46 17.94,17.46 18.57,18.1 22.86,18.1 23.02,17.94 IC1.13
  Bottom 0.127: v15.72,17.46 16.99,18.73 16.99,42.86 17.78,43.66 17.78,46.35 18.89,47.47 22.23,47.47 22.23,48.42 PORTA.4
RX3  (via drill 0.3)
  Top 0.127: v39.05,16.67 27.62,16.67 27.62,17.78 IC1.22 | v41.91,31.59 44.77,34.45 46.35,34.45 47.47,35.56 PORTB.12
  Bottom 0.127: v39.05,16.67 38.89,16.83 38.89,23.18 39.53,23.81 39.53,29.21 v41.91,31.59
SWCLK  (via drill 0.3)
  Top 0.127: v34.61,26.83 v30.48,26.83 29.21,26.83 28.73,26.35 IC1.37 | v31.11,3.17 28.42,0.48 18.41,0.48 15.88,3.02 SWD_PIN.4
  Bottom 0.127: v34.61,26.83 35.4,27.62 35.4,43.81 37.47,45.88 PORTA.15 | v31.11,3.17 31.11,19.84 30.48,20.48 v30.48,26.83
SWDIO  (via drill 0.3)
  Top 0.127: v24.13,22.54 26.19,22.54 27.46,23.81 30,23.81 IC1.34 | v26.51,43.66 33.66,43.66 33.66,47.15 34.92,48.42 PORTA.14
  Bottom 0.127: SWD_PIN.2 18.41,3.17 18.41,4.13 21.43,7.14 21.43,17.46 23.5,19.53 23.5,21.91 v24.13,22.54 23.34,23.34 23.34,40.48 v26.51,43.66
SWO  (via drill 0.3)
  Top 0.127: 31.11,27.62 41.27,27.62 42.86,29.21 47.78,29.21 49.37,30.8 49.37,49.37 47.15,49.37 46.35,48.58 46.35,45.72 PORTB.4 | 31.11,27.62 27.62,27.62 27.62,26.35 IC1.39 | v14.61,7.3 16.99,9.68 v31.75,9.68 | 31.11,27.62 v31.11,27.46
  Bottom 0.127: SWD_PIN.5 14.61,6.99 v14.61,7.3 | v31.75,9.68 31.59,9.84 31.59,19.84 31.11,20.32 v31.11,27.46
TX1  (via drill 0.3)
  Top 0.127: v8.89,26.19 22.54,26.19 22.54,23.18 23.81,21.91 30,21.91 IC1.30 | v31.11,37.78 30.96,37.62 8.1,37.62 v7.62,38.1
  Bottom 0.127: v8.89,26.19 7.62,27.46 7.62,36.35 6.99,36.99 U2.3 6.99,37.47 v7.62,38.1 | v31.11,37.78 31.11,47.31 30,48.42 PORTA.10
TX2  (via drill 0.3)
  Top 0.127: v15.08,19.37 15.56,18.89 18.41,18.89 18.57,19.05 21.43,19.05 21.59,19.21 IC1.12 | v17.14,43.97 17.46,44.29 v20.64,44.29
  Bottom 0.127: v15.08,19.37 16.51,20.8 16.51,43.34 v17.14,43.97 | v20.64,44.29 22.23,45.88 PORTA.3
UNIC  (via drill 0.3)
  Top 0.127: v44.61,9.68 44.61,8.57 C7.2
  Bottom 0.127: RCAN1.1 44.61,11.11 v44.61,9.68 44.61,8.41 RCAN3.1 44.77,8.26 47.47,8.26 RCAN4.2 47.47,8.41 47.47,11.27 RCAN2.2
VBUS  (via drill 0.3)
  Top 0.127: v37.78,19.53 38.73,20.48 40.16,20.48 | 40.16,20.48 41.75,20.48 CN1.VBUS 40.16,20.48 | v28.73,40.32 28.1,40.96 11.59,40.96 11.43,40.8 8.89,40.8 8.26,41.43 USB_PROGRAM.VBUS | 40.16,20.48 40.16,17.94 v30.48,17.94
  Bottom 0.127: v37.78,19.53 37.78,18.89 36.99,18.1 C2.1 | v28.73,40.32 28.73,38.73 29.21,38.26 AMS1117-3.3.3 29.37,38.1 29.53,37.94 29.53,18.89 v30.48,17.94
VCC  (via drill 0.3)
  Top 0.127: v34.61,25.56 30.8,25.56 30.16,24.92 IC1.36 | v36.04,35.08 36.04,36.35 35.56,36.35 RUSB.1 35.56,36.51 v26.99,36.51 6.03,36.51 5.71,36.2 5.71,26.83 | 10.48,18.89 10.48,20.8 10.32,20.8 LED3.A | 10.48,18.89 10.48,17.3 LED5.A | v4.45,22.38 4.45,20.95 4.92,20.95 LED2.A 5.08,20.8 5.08,18.89 | v4.45,26.83 5.71,26.83 | 5.71,26.83 22.54,26.83 23.02,26.35 IC1.48 | 5.08,18.89 5.08,17.3 LED4.A 4.92,17.14 3.49,15.72 1.43,15.72 1.27,15.56 1.27,11.91 2.54,11.91 LEDPWR.A 2.54,9.21 | 5.08,18.89 10.48,18.89 | v29.37,17.3 29.21,17.3 28.73,17.78 IC1.24 | 22.86,5.71 18.41,5.71 SWD_PIN.1 18.26,5.71 17.3,6.67 9.21,6.67 8.73,6.19 S2.2 8.57,6.19 2.22,6.19 | 22.86,5.71 BOOT0.1 | 22.86,5.71 BOOT1.1 22.86,5.87 24.77,7.78 v29.21,7.78 | 2.54,9.21 4.13,9.21 R1.2 | 2.22,6.19 2.22,9.21 2.54,9.21 | 2.22,6.19 S2.1
  Bottom 0.127: v34.61,25.56 36.04,26.99 v36.04,35.08 | v26.99,36.51 26.99,38.1 AMS1117-3.3.2 | v4.45,22.38 v4.45,26.83 U2.16 | v29.37,17.3 29.53,17.14 29.53,14.29 C5.1 29.69,14.13 30.48,13.34 30.48,7.78 | C6.2 39.85,12.06 39.85,10.16 U1.3 39.85,10 40.32,9.53 40.32,7.3 43.34,4.29 43.34,1.11 42.7,0.48 34.13,0.48 34.13,2.54 | 34.13,2.54 34.13,11.91 C1.1 | 30.48,7.78 30.48,2.86 30.8,2.54 34.13,2.54 | v29.21,7.78 30.48,7.78
XI7  (via drill 0.3)
  Top 0.127: v13.18,39.21 13.34,39.37 18.41,39.37 Q2.1
  Bottom 0.127: U2.7 12.06,37.15 11.91,37.31 11.91,39.05 C8.1 11.91,39.21 v13.18,39.21
XI8  (via drill 0.3)
  Top 0.127: v13.97,35.4 17.78,35.4 18.41,34.77 Q2.2
  Bottom 0.127: 12.86,36.51 11.43,35.08 11.43,29.05 C9.1 | 12.86,36.51 13.34,36.99 U2.8 | 12.86,36.51 v13.97,35.4

### Text on the board
tNames: PA15 | PB0 | PA1 | UART1 | PB1 | PA0 | PB2 | PB4 | PA2 | PA4 | PA6 | PA8 | PA10 | PA12 | PB6 | PB8 | PB10 | PB12 | PB15 | PB14 | STM32F103C8T6 | SWO | RESET | VCC | GND | SWCLK | SWDIO